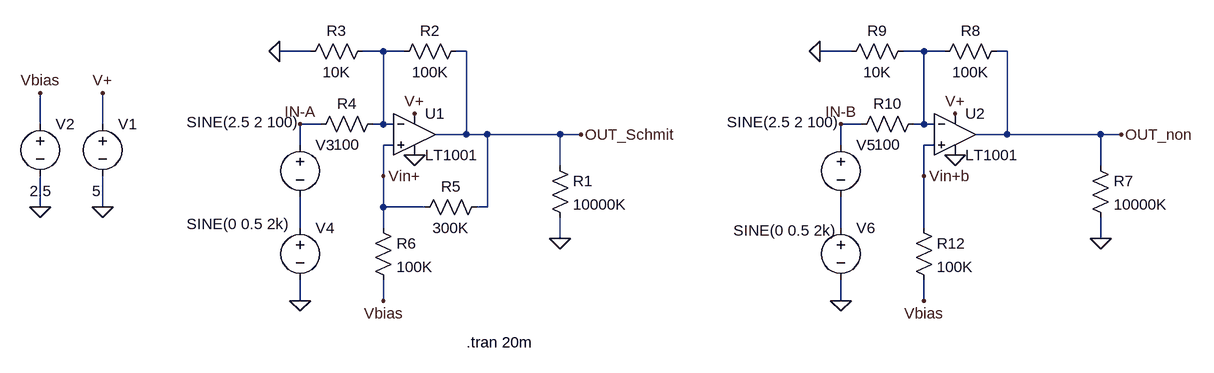
[diagram p0: schematic Fig_8-16_LT1001_Shmit_Test.asc]
Fig_8-16_LT1001_Shmit_Test.asc, the LTspice schematic file:
Version 4
SHEET 1 1448 680
WIRE 64 48 16 48
WIRE 176 48 144 48
WIRE 208 48 176 48
WIRE 304 48 288 48
WIRE 896 48 848 48
WIRE 1008 48 976 48
WIRE 1040 48 1008 48
WIRE 1136 48 1120 48
WIRE -352 160 -352 112
WIRE -256 160 -256 112
WIRE 80 160 48 160
WIRE 176 160 176 48
WIRE 176 160 160 160
WIRE 192 160 176 160
WIRE 912 160 880 160
WIRE 1008 160 1008 48
WIRE 1008 160 992 160
WIRE 1024 160 1008 160
WIRE 304 176 304 48
WIRE 304 176 256 176
WIRE 336 176 304 176
WIRE 448 176 336 176
WIRE 480 176 448 176
WIRE 1136 176 1136 48
WIRE 1136 176 1088 176
WIRE 1280 176 1136 176
WIRE 1312 176 1280 176
WIRE 48 192 48 160
WIRE 192 192 176 192
WIRE 880 192 880 160
WIRE 1024 192 1008 192
WIRE 448 224 448 176
WIRE 1280 224 1280 176
WIRE 176 240 176 192
WIRE 1008 240 1008 192
WIRE -352 288 -352 240
WIRE -256 288 -256 240
WIRE 176 288 176 240
WIRE 240 288 176 288
WIRE 336 288 336 176
WIRE 336 288 320 288
WIRE 48 320 48 272
WIRE 176 320 176 288
WIRE 880 320 880 272
WIRE 1008 320 1008 240
WIRE 448 336 448 304
WIRE 1280 336 1280 304
WIRE 48 432 48 400
WIRE 176 432 176 400
WIRE 880 432 880 400
WIRE 1008 432 1008 400
FLAG -256 288 0
FLAG 48 432 0
FLAG -256 112 V+
FLAG 480 176 OUT_Schmit
FLAG 16 48 0
FLAG 448 336 0
FLAG 224 144 V+
FLAG 224 208 0
FLAG 176 240 Vin+
FLAG -352 288 0
FLAG -352 112 Vbias
FLAG 176 432 Vbias
FLAG 880 432 0
FLAG 1312 176 OUT_non
FLAG 848 48 0
FLAG 1280 336 0
FLAG 1056 144 V+
FLAG 1056 208 0
FLAG 1008 240 Vin+b
FLAG 1008 432 Vbias
FLAG 48 160 IN-A
FLAG 880 160 IN-B
SYMBOL Opamps\\LT1001 224 112 R0
SYMATTR InstName U1
SYMBOL voltage -256 144 R0
WINDOW 3 -16 119 Left 2
WINDOW 123 0 0 Left 2
WINDOW 39 0 0 Left 2
SYMATTR Value 5
SYMATTR InstName V1
SYMBOL voltage 48 176 R0
WINDOW 3 -175 -19 Left 2
WINDOW 123 0 0 Left 2
WINDOW 39 0 0 Left 2
SYMATTR Value SINE(2.5 2 100)
SYMATTR InstName V3
SYMBOL res 432 208 R0
SYMATTR InstName R1
SYMATTR Value 10000K
SYMBOL res 192 64 R270
WINDOW 0 32 56 VTop 2
WINDOW 3 0 56 VBottom 2
SYMATTR InstName R2
SYMATTR Value 100K
SYMBOL res 48 64 R270
WINDOW 0 32 56 VTop 2
WINDOW 3 0 56 VBottom 2
SYMATTR InstName R3
SYMATTR Value 10K
SYMBOL res 64 176 R270
WINDOW 0 32 56 VTop 2
WINDOW 3 0 56 VBottom 2
SYMATTR InstName R4
SYMATTR Value 100
SYMBOL res 224 304 R270
WINDOW 0 32 56 VTop 2
WINDOW 3 0 56 VBottom 2
SYMATTR InstName R5
SYMATTR Value 300K
SYMBOL res 160 304 R0
SYMATTR InstName R6
SYMATTR Value 100K
SYMBOL voltage -352 144 R0
WINDOW 3 -16 119 Left 2
WINDOW 123 0 0 Left 2
WINDOW 39 0 0 Left 2
SYMATTR Value 2.5
SYMATTR InstName V2
SYMBOL voltage 48 304 R0
WINDOW 3 -175 10 Left 2
WINDOW 123 0 0 Left 2
WINDOW 39 0 0 Left 2
SYMATTR Value SINE(0 0.5 2k)
SYMATTR InstName V4
SYMBOL Opamps\\LT1001 1056 112 R0
SYMATTR InstName U2
SYMBOL voltage 880 176 R0
WINDOW 3 -175 -19 Left 2
WINDOW 123 0 0 Left 2
WINDOW 39 0 0 Left 2
SYMATTR Value SINE(2.5 2 100)
SYMATTR InstName V5
SYMBOL res 1264 208 R0
SYMATTR InstName R7
SYMATTR Value 10000K
SYMBOL res 1024 64 R270
WINDOW 0 32 56 VTop 2
WINDOW 3 0 56 VBottom 2
SYMATTR InstName R8
SYMATTR Value 100K
SYMBOL res 880 64 R270
WINDOW 0 32 56 VTop 2
WINDOW 3 0 56 VBottom 2
SYMATTR InstName R9
SYMATTR Value 10K
SYMBOL res 896 176 R270
WINDOW 0 32 56 VTop 2
WINDOW 3 0 56 VBottom 2
SYMATTR InstName R10
SYMATTR Value 100
SYMBOL res 992 304 R0
SYMATTR InstName R12
SYMATTR Value 100K
SYMBOL voltage 880 304 R0
WINDOW 3 -165 20 Left 2
WINDOW 123 0 0 Left 2
WINDOW 39 0 0 Left 2
SYMATTR Value SINE(0 0.5 2k)
SYMATTR InstName V6
TEXT 304 496 Left 2 !.tran 20m

The netlist it stands for:
* Fig_8-16_LT1001_Shmit_Test.asc
XU1 Vin+ N001 V+ 0 OUT_Schmit LT1001  ; pins In+ In- V+ V- OUT
V1 V+ 0 5
V3 IN-A N003 SINE(2.5 2 100)
R1 OUT_Schmit 0 10000K
R2 N001 OUT_Schmit 100K
R3 0 N001 10K
R4 IN-A N001 100
R5 Vin+ OUT_Schmit 300K
R6 Vin+ Vbias 100K
V2 Vbias 0 2.5
V4 N003 0 SINE(0 0.5 2k)
XU2 Vin+b N002 V+ 0 OUT_non LT1001  ; pins In+ In- V+ V- OUT
V5 IN-B N004 SINE(2.5 2 100)
R7 OUT_non 0 10000K
R8 N002 OUT_non 100K
R9 0 N002 10K
R10 IN-B N002 100
R12 Vin+b Vbias 100K
V6 N004 0 SINE(0 0.5 2k)
.tran 20m
.lib LTC.lib
.backanno
.end